# Altium schematic sheet User Interface.SchDoc: Buttons/LEDs
size Tabloid; ApprovedBy: NA; CompanyName: Cospan Design LLC; DrawnBy: Dave McCoy; Engineer: Dave McCoy; DocumentNumber: 15; Revision: A; SheetNumber: 15; SheetTotal: 20; Client: Public; Project: Enigma; ProjectPrettyName: Enigma
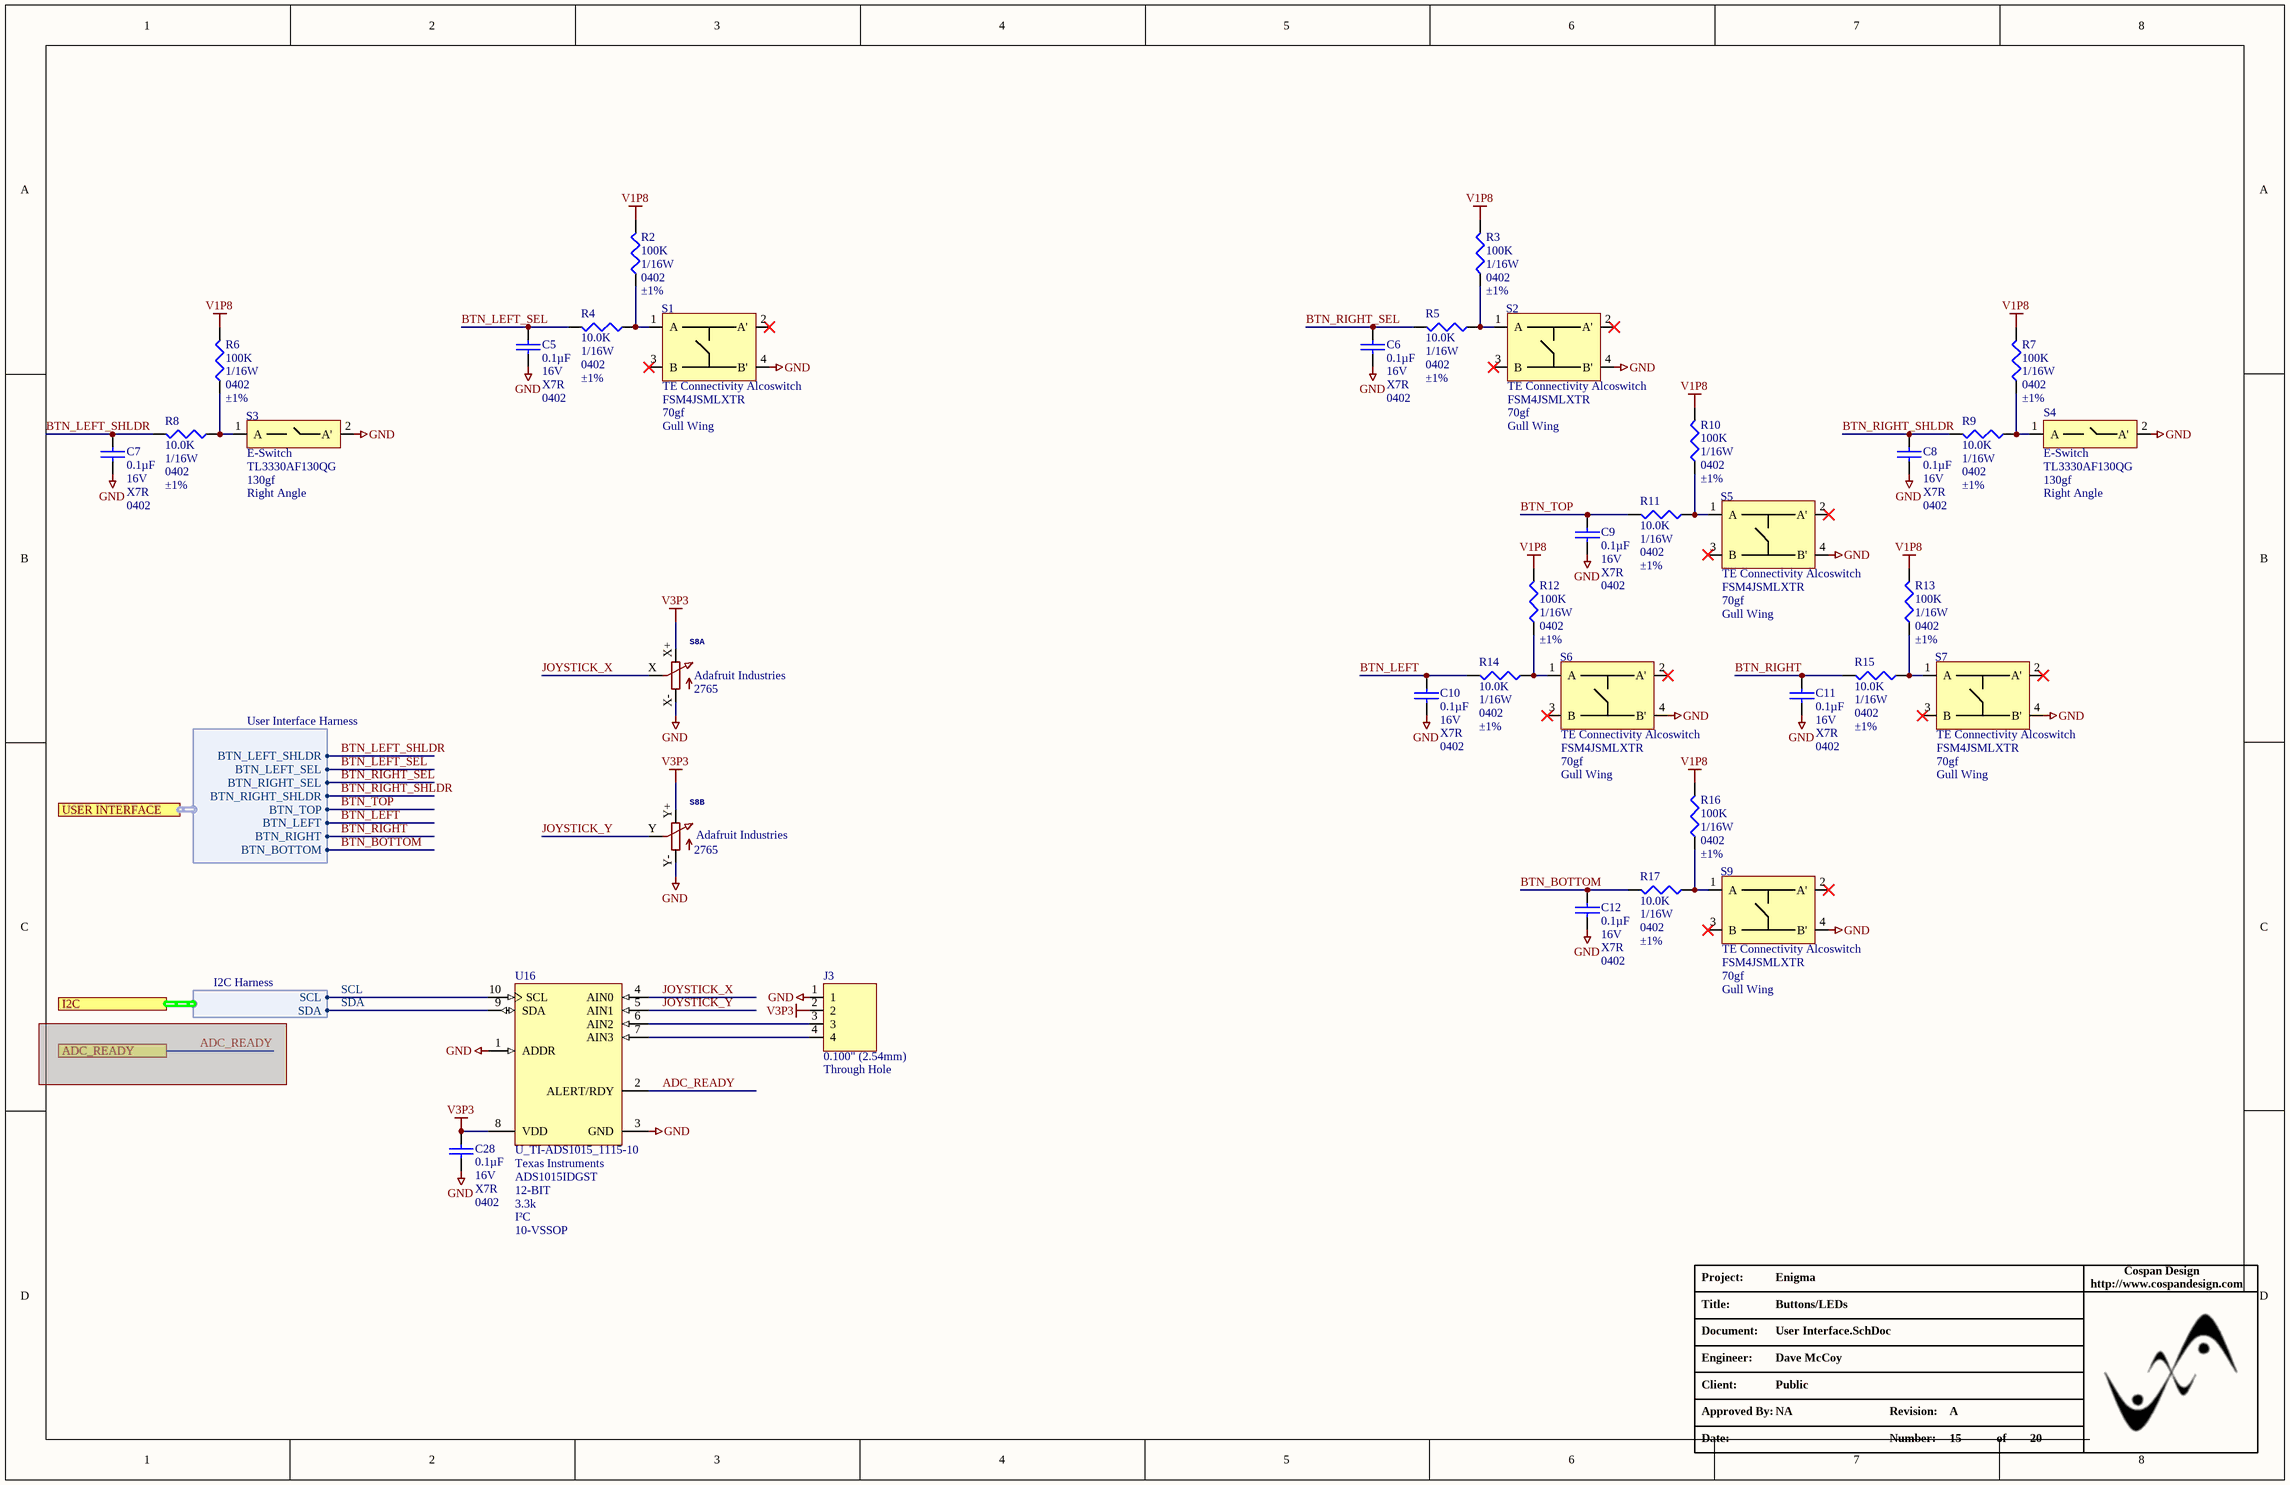
[diagram p0: User Interface.SchDoc]

## Parts
C5  Capacitance: 0.1µF  Voltage - Rated: 16V  Temperature Coefficient: X7R  Package / Case: 0402  [C_0402]  (hidden comment: 0.1uF)
C6  Capacitance: 0.1µF  Voltage - Rated: 16V  Temperature Coefficient: X7R  Package / Case: 0402  [C_0402]  (hidden comment: 0.1uF)
C7  Capacitance: 0.1µF  Voltage - Rated: 16V  Temperature Coefficient: X7R  Package / Case: 0402  [C_0402]  (hidden comment: 0.1uF)
C8  Capacitance: 0.1µF  Voltage - Rated: 16V  Temperature Coefficient: X7R  Package / Case: 0402  [C_0402]  (hidden comment: 0.1uF)
C9  Capacitance: 0.1µF  Voltage - Rated: 16V  Temperature Coefficient: X7R  Package / Case: 0402  [C_0402]  (hidden comment: 0.1uF)
C10  Capacitance: 0.1µF  Voltage - Rated: 16V  Temperature Coefficient: X7R  Package / Case: 0402  [C_0402]  (hidden comment: 0.1uF)
C11  Capacitance: 0.1µF  Voltage - Rated: 16V  Temperature Coefficient: X7R  Package / Case: 0402  [C_0402]  (hidden comment: 0.1uF)
C12  Capacitance: 0.1µF  Voltage - Rated: 16V  Temperature Coefficient: X7R  Package / Case: 0402  [C_0402]  (hidden comment: 0.1uF)
C28  Capacitance: 0.1µF  Voltage - Rated: 16V  Temperature Coefficient: X7R  Package / Case: 0402  [C_0402]  (hidden comment: 0.1uF)
J3  Pitch: 0.100" (2.54mm)  Mounting Type: Through Hole  [HDR_1X4_FEMALE]  (hidden comment: J_HDR1X4_THRHOLE_VERT_FEMALE)
R2  Resistance In Ohms: 100K  Power (Watts): 1/16W  Case: 0402  Tolerance: ±1%  [R_0402]  (hidden comment: R_0402_100K)
R3  Resistance In Ohms: 100K  Power (Watts): 1/16W  Case: 0402  Tolerance: ±1%  [R_0402]  (hidden comment: R_0402_100K)
R4  Resistance In Ohms: 10.0K  Power (Watts): 1/16W  Case: 0402  Tolerance: ±1%  [R_0402]  (hidden comment: R_0402_10.0K)
R5  Resistance In Ohms: 10.0K  Power (Watts): 1/16W  Case: 0402  Tolerance: ±1%  [R_0402]  (hidden comment: R_0402_10.0K)
R6  Resistance In Ohms: 100K  Power (Watts): 1/16W  Case: 0402  Tolerance: ±1%  [R_0402]  (hidden comment: R_0402_100K)
R7  Resistance In Ohms: 100K  Power (Watts): 1/16W  Case: 0402  Tolerance: ±1%  [R_0402]  (hidden comment: R_0402_100K)
R8  Resistance In Ohms: 10.0K  Power (Watts): 1/16W  Case: 0402  Tolerance: ±1%  [R_0402]  (hidden comment: R_0402_10.0K)
R9  Resistance In Ohms: 10.0K  Power (Watts): 1/16W  Case: 0402  Tolerance: ±1%  [R_0402]  (hidden comment: R_0402_10.0K)
R10  Resistance In Ohms: 100K  Power (Watts): 1/16W  Case: 0402  Tolerance: ±1%  [R_0402]  (hidden comment: R_0402_100K)
R11  Resistance In Ohms: 10.0K  Power (Watts): 1/16W  Case: 0402  Tolerance: ±1%  [R_0402]  (hidden comment: R_0402_10.0K)
R12  Resistance In Ohms: 100K  Power (Watts): 1/16W  Case: 0402  Tolerance: ±1%  [R_0402]  (hidden comment: R_0402_100K)
R13  Resistance In Ohms: 100K  Power (Watts): 1/16W  Case: 0402  Tolerance: ±1%  [R_0402]  (hidden comment: R_0402_100K)
R14  Resistance In Ohms: 10.0K  Power (Watts): 1/16W  Case: 0402  Tolerance: ±1%  [R_0402]  (hidden comment: R_0402_10.0K)
R15  Resistance In Ohms: 10.0K  Power (Watts): 1/16W  Case: 0402  Tolerance: ±1%  [R_0402]  (hidden comment: R_0402_10.0K)
R16  Resistance In Ohms: 100K  Power (Watts): 1/16W  Case: 0402  Tolerance: ±1%  [R_0402]  (hidden comment: R_0402_100K)
R17  Resistance In Ohms: 10.0K  Power (Watts): 1/16W  Case: 0402  Tolerance: ±1%  [R_0402]  (hidden comment: R_0402_10.0K)
S1  Manufacturer: TE Connectivity Alcoswitch  Manufacturer Part Number: FSM4JSMLXTR  Operating Force: 70gf  Termination: Gull Wing  [TACTILE_1571563_2]  (hidden comment: S_TACTILE_1571563_2_BUTTON)
S2  Manufacturer: TE Connectivity Alcoswitch  Manufacturer Part Number: FSM4JSMLXTR  Operating Force: 70gf  Termination: Gull Wing  [TACTILE_1571563_2]  (hidden comment: S_TACTILE_1571563_2_BUTTON)
S3  Manufacturer: E-Switch  Operating Force: 130gf  Orientation: Right Angle  [TL3330AF130QG]  (hidden comment: S_TACTILE_ RA_TL3330AF130QG_BUTTON)
S4  Manufacturer: E-Switch  Operating Force: 130gf  Orientation: Right Angle  [TL3330AF130QG]  (hidden comment: S_TACTILE_ RA_TL3330AF130QG_BUTTON)
S5  Manufacturer: TE Connectivity Alcoswitch  Manufacturer Part Number: FSM4JSMLXTR  Operating Force: 70gf  Termination: Gull Wing  [TACTILE_1571563_2]  (hidden comment: S_TACTILE_1571563_2_BUTTON)
S6  Manufacturer: TE Connectivity Alcoswitch  Manufacturer Part Number: FSM4JSMLXTR  Operating Force: 70gf  Termination: Gull Wing  [TACTILE_1571563_2]  (hidden comment: S_TACTILE_1571563_2_BUTTON)
S7  Manufacturer: TE Connectivity Alcoswitch  Manufacturer Part Number: FSM4JSMLXTR  Operating Force: 70gf  Termination: Gull Wing  [TACTILE_1571563_2]  (hidden comment: S_TACTILE_1571563_2_BUTTON)
S8  Manufacturer: Adafruit Industries  Manufacturer Part Number: 2765  [JOYSTICK_ANALOG_MINITHM]  (hidden comment: S_JOYSTICK_ANALOG_XY)  (parts A,B of 2)
S9  Manufacturer: TE Connectivity Alcoswitch  Manufacturer Part Number: FSM4JSMLXTR  Operating Force: 70gf  Termination: Gull Wing  [TACTILE_1571563_2]  (hidden comment: S_TACTILE_1571563_2_BUTTON)
U16  U_TI-ADS1015_1115-10  Manufacturer: Texas Instruments  Manufacturer Part Number: ADS1015IDGST  Number of Bits: 12-BIT  Sampling Rate (Per Second): 3.3k  Data Interface: I²C  Supplier Device Package: 10-VSSOP  [TI-DGS10_L]

## Ports
ADC_READY, I2C (harness I2C Harness), USER INTERFACE (harness User Interface Harness)

## Harnesses
User Interface Harness: BTN_LEFT_SHLDR, BTN_LEFT_SEL, BTN_RIGHT_SEL, BTN_RIGHT_SHLDR, BTN_TOP, BTN_LEFT, BTN_RIGHT, BTN_BOTTOM
I2C Harness: SCL, SDA

## Nets
GND: C5.1 C6.1 C7.1 C8.1 C9.1 C10.1 C11.1 C12.1 C28.1 J3.1 S1.4(B') S2.4(B') S3.2(A') S4.2(A') S5.4(B') S6.4(B') S7.4(B') S8.X-(A) S8.Y-(A) S9.4(B') U16.1(ADDR) U16.3(GND)
V1P8: R2.1 R3.1 R6.1 R7.1 R10.1 R12.1 R13.1 R16.1
V3P3: C28.2 J3.2 S8.X+(E) S8.Y+(E) U16.8(VDD)
ADC_READY: U16.2(ALERT/RDY)
BTN_BOTTOM: C12.2 R17.1 ; port USER INTERFACE.BTN_BOTTOM
BTN_LEFT: C10.2 R14.1 ; port USER INTERFACE.BTN_LEFT
BTN_LEFT_SEL: C5.2 R4.1 ; port USER INTERFACE.BTN_LEFT_SEL
BTN_LEFT_SHLDR: C7.2 R8.1 ; port USER INTERFACE.BTN_LEFT_SHLDR
BTN_RIGHT: C11.2 R15.1 ; port USER INTERFACE.BTN_RIGHT
BTN_RIGHT_SEL: C6.2 R5.1 ; port USER INTERFACE.BTN_RIGHT_SEL
BTN_RIGHT_SHLDR: C8.2 R9.1 ; port USER INTERFACE.BTN_RIGHT_SHLDR
BTN_TOP: C9.2 R11.1 ; port USER INTERFACE.BTN_TOP
JOYSTICK_X: S8.X(S) U16.4(AIN0)
JOYSTICK_Y: S8.Y(S) U16.5(AIN1)
SCL: U16.10(SCL) ; port I2C.SCL
SDA: U16.9(SDA) ; port I2C.SDA
NetJ3_3: J3.3 U16.6(AIN2)
NetJ3_4: J3.4 U16.7(AIN3)
NetR2_2: R2.2 R4.2 S1.1(A)
NetR3_2: R3.2 R5.2 S2.1(A)
NetR6_2: R6.2 R8.2 S3.1(A)
NetR7_2: R7.2 R9.2 S4.1(A)
NetR10_2: R10.2 R11.2 S5.1(A)
NetR12_2: R12.2 R14.2 S6.1(A)
NetR13_2: R13.2 R15.2 S7.1(A)
NetR16_2: R16.2 R17.2 S9.1(A)

Not connected (* = marked no-connect by the designer): S1 2(A')* 3(B)*; S2 2(A')* 3(B)*; S5 2(A')* 3(B)*; S6 2(A')* 3(B)*; S7 2(A')* 3(B)*; S9 2(A')* 3(B)*

## Notes on the sheet
- Project:
- http://www.cospandesign.com
- Cospan Design
- Document:
- Engineer:
- Title:
- Client:
- Approved By:
- Revision:
- Date:
- Number:
- of

## Library data of the parts
C5-C12 C28 = C_0402_0.1UF_16V: CAP CER .10UF 16V X7R 0402; Manufacturer: Murata Electronics North America; Manufacturer Part Number: GRM155R71C104KA88J; Tolerance: ±10%; Supplier 1: Digi-Key; RoHS: RoHS Compliant; Category: Capacitors; Stock 1: 18103134; Pricing 1: 1=0.1, 10=0.014, 100=0.0062, 500=0.00442, 1000=0.00348, 2500=0.00316, 5000=0.00291 (USD); Packaging: Cut Tape (CT); Part Status: Active; Operating Temperature: -55°C ~ 125°C; Features: -; Ratings: -; Applications: General Purpose; Mounting Type: Surface Mount, MLCC; Size / Dimension: 0.039" L x 0.020" W (1.00mm x 0.50mm); Height - Seated (Max): -; Thickness (Max): 0.022" (0.55mm); Lead Spacing: -; ComponentLink1URL: http://www.murata.com/~/media/webrenewal/support/library/catalog/products/capacitor/mlcc/c02e.ashx?la=en-us; ComponentLink1Description: http://www.murata.com/~/media/webrenewal/support/library/catalog/products/capacitor/mlcc/c02e.ashx?la=en-us; Supplier Part Number 1: 490-6328-1-ND
J3 = J_HDR1X4_THRHOLE_VERT_FEMALE: CONN HEADER .100" 4POS TIN PCB; Manufacturer: Samtec Inc; Manufacturer Part Number: SSW-116-01-T-S; Connector Type: Receptacle; Number of Positions: 16; Number of Positions Loaded: All; Supplier 1: Digi-Key; Supplier Part Number 1: SAM1213-16-ND; RoHS: RoHS Compliant; Category: Connectors, Interconnects; Stock 1: 0; Pricing: 1=1.65, 10=1.476, 100=1.2158, 500=0.96106, 1000=0.825, 5000=0.75264, 10000=0.72369 (USD); Contact Type: Female Socket; Number of Rows: 1; Row Spacing: -; Termination: Solder; Fastening Type: -; Features: -; Contact Finish: Tin; Contact Finish Thickness: -; Color: Black; Packaging: Bulk; ComponentLink1URL: http://www.samtec.com/documents/webfiles/cpdf/SSW-1XX-XX-XXX-X-XX-XXX-XX-MKT.pdf; ComponentLink1Description: http://www.samtec.com/documents/webfiles/cpdf/SSW-1XX-XX-XXX-X-XX-XXX-XX-MKT.pdf
R2 R3 R6 R7 R10 R12 R13 R16 = R_0402_100K: RES SMD 100K OHM 1% 1/16W 0402; Manufacturer: Yageo; Manufacturer Part Number: RC0402FR-07100KL; Temperature Coefficient: ±100ppm/°C; Supplier 1: Digi-Key; RoHS: RoHS Compliant; Category: Resistors; Stock 1: 4989982; Pricing 1: 1=0.1, 10=0.013, 25=0.0096, 100=0.0054, 250=0.00412, 500=0.00328, 1000=0.00242, 2500=0.0021, 5000=0.00173 (USD); Packaging: Cut Tape (CT); Resistance (Ohms): 100k; Composition: Thick Film; Features: Moisture Resistant; Operating Temperature: -55°C ~ 155°C; Package / Case: 0402 (1005 Metric); Supplier Device Package: 0402; Size / Dimension: 0.039" L x 0.020" W (1.00mm x 0.50mm); Height: 0.016" (0.40mm); Number of Terminations: 2; ComponentLink1URL: http://www.yageo.com/NewPortal/yageodocoutput?fileName=/pdf/R-Chip/PYu-RC_Group_51_RoHS_L_3.pdf; ComponentLink1Description: http://www.yageo.com/NewPortal/yageodocoutput?fileName=/pdf/R-Chip/PYu-RC_Group_51_RoHS_L_3.pdf; Supplier Part Number 1: 311-100KLRCT-ND
R4 R5 R8 R9 R11 R14 R15 R17 = R_0402_10.0K: RES 10.0K OHM 1/16W 1% 0402 SMD; Manufacturer: Stackpole Electronics Inc; Manufacturer Part Number: RMCF0402FT10K0; Resistance (Ohms): 10k; Temperature Coefficient: ±100ppm/°C; Supplier 1: Digi-Key; Supplier Part Number 1: RMCF0402FT10K0CT-ND; RoHS: RoHS Compliant; Category: Resistors; Stock 1: 234525; Pricing: 1=0.04, 10=0.025, 50=0.0138, 100=0.0105, 250=0.0078, 500=0.00576, 1000=0.00384, 2500=0.00324, 5000=0.0027 (USD); Composition: Thick Film; Features: -; Package / Case: 0402 (1005 Metric); Size / Dimension: 0.039" L x 0.020" W (1.00mm x 0.50mm); Height: 0.016" (0.40mm); Number of Terminations: 2; Packaging: Cut Tape (CT); ComponentLink1URL: http://www.seielect.com/Catalog/SEI-RMCF_RMCP.pdf; ComponentLink1Description: http://www.seielect.com/Catalog/SEI-RMCF_RMCP.pdf
S1 S2 S5-S7 S9 = S_TACTILE_1571563_2_BUTTON: SWITCH TACTILE SPST-NO 0.05A 24V; Mechanical Life: 1000000Cycles; Actuator Material: Nylon,Polyamide; Illumination Type: Non-Illuminated; Throw Configuration: SPST; Switch Travel: 0.25mm; Supplier 1: Digikey; Stock 1: 4653; Pricing 1: 1=0.68, 10=0.655, 25=0.6428, 50=0.6184, 100=0.5335, 500=0.4607, 1000=0.3637, 1200=0.3066 (USD); Min Operating Temperature: -35°C; Max Operating Temperature: 85°C; Package Quantity: 4800; Packaging: Tape and Reel; Supplier Part Number 1: 450-2057-1-ND
S3 S4 = S_TACTILE_ RA_TL3330AF130QG_BUTTON: SWITCH TACTILE SPST-NO 0.05A 12V; Mechanical Life: 50000Cycles; Actuator Material: Nylon,Polyamide; Throw Configuration: SPST; Contact Resistance: 100mR; Current Rating: 50mA; Illumination Type: Non-Illuminated,Illuminated; Switch Travel: 0.25mm; Actuator Length: 1mm; Supplier 1: Digikey; Stock 1: 47904; Pricing 1: 1=0.47, 10=0.448, 25=0.44, 50=0.4236, 100=0.3654, 250=0.3322, 500=0.3156, 1000=0.2492 (USD); Mount: Surface Mount; Case/Package: SMD/SMT; Contact Material: Silver; Colour: Black; Contact Plating: Silver; Min Operating Temperature: -30°C; Max Operating Temperature: 70°C; Package Quantity: 1; Packaging: Tape and Reel; Voltage Rating (DC): 12V; Max Voltage Rating (DC): 12V; Termination: Gull Wing; Electrical Life: 50000Cycles; REACH SVHC: No SVHC; Lead Free: Lead Free; ComponentLink1URL: https://datasheet.ciiva.com/2900/p010950-2900785.pdf; ComponentLink1Description: https://datasheet.ciiva.com/2900/p010950-2900785.pdf; ComponentLink2URL: https://datasheet.ciiva.com/2900/p010950-2900786.pdf; ComponentLink2Description: https://datasheet.ciiva.com/2900/p010950-2900786.pdf; ComponentLink3URL: https://datasheet.ciiva.com/2900/p010950-2900787.pdf; ComponentLink3Description: https://datasheet.ciiva.com/2900/p010950-2900787.pdf; ComponentLink4URL: https://datasheet.ciiva.com/23713/tl3330-23713381.pdf; ComponentLink4Description: https://datasheet.ciiva.com/23713/tl3330-23713381.pdf; Supplier Part Number 1: EG4388CT-ND; Manufacturer Part Number: TL3330AF130QG
S8 = S_JOYSTICK_ANALOG_XY: Resistance: 10KR; Supplier 1: Digikey; Stock 1: 0; Pricing 1: 1=2.5, 10=2.25 (USD); Packaging: Bulk; Length: 0.707inch; Height: 0.472inch; Width: 0.697inch; Supplier Part Number 1: 1528-1730-ND
U16 = U_TI-ADS1015_1115-10: IC ADC 12BIT I2C W/REF 10-MSOP; Number of Inputs: 2, 4; Input Type: Differential, Single Ended; Configuration: MUX-PGA-ADC; Ratio - S/H:ADC: 1:1; Number of A/D Converters: 1; Architecture: Sigma-Delta; Reference Type: Internal; Voltage - Supply, Analog: 2 V ~ 5.5 V; Supplier 1: Digi-Key; RoHS: RoHS Compliant; Category: Integrated Circuits (ICs); Stock 1: 1516; Pricing 1: 1=3.42, 10=3.065, 25=2.756, 100=2.5067 (USD); Packaging: Cut Tape (CT); Voltage - Supply, Digital: 2 V ~ 5.5 V; Features: PGA; Operating Temperature: -40°C ~ 125°C; Package / Case: 10-TFSOP, 10-MSOP (0.118", 3.00mm Width); ComponentLink1URL: http://www.ti.com/lit/ds/symlink/ads1013.pdf; ComponentLink1Description: http://www.ti.com/lit/ds/symlink/ads1013.pdf; Supplier Part Number 1: 296-25227-1-ND